# Altium schematic sheet RGMII_SDIO_I2S.SchDoc: RK3399 COB Design V1.0
size A3; Author: ABC; Organization: Altium Limited; Address1: L3, 12a Rodborough Rd; Address2: Frenchs Forest; Address3: NSW; Address4: Australia 2086; DocumentNumber: 11; SheetNumber: 11; SheetTotal: 27; PROJECT CODE: A_V1.0
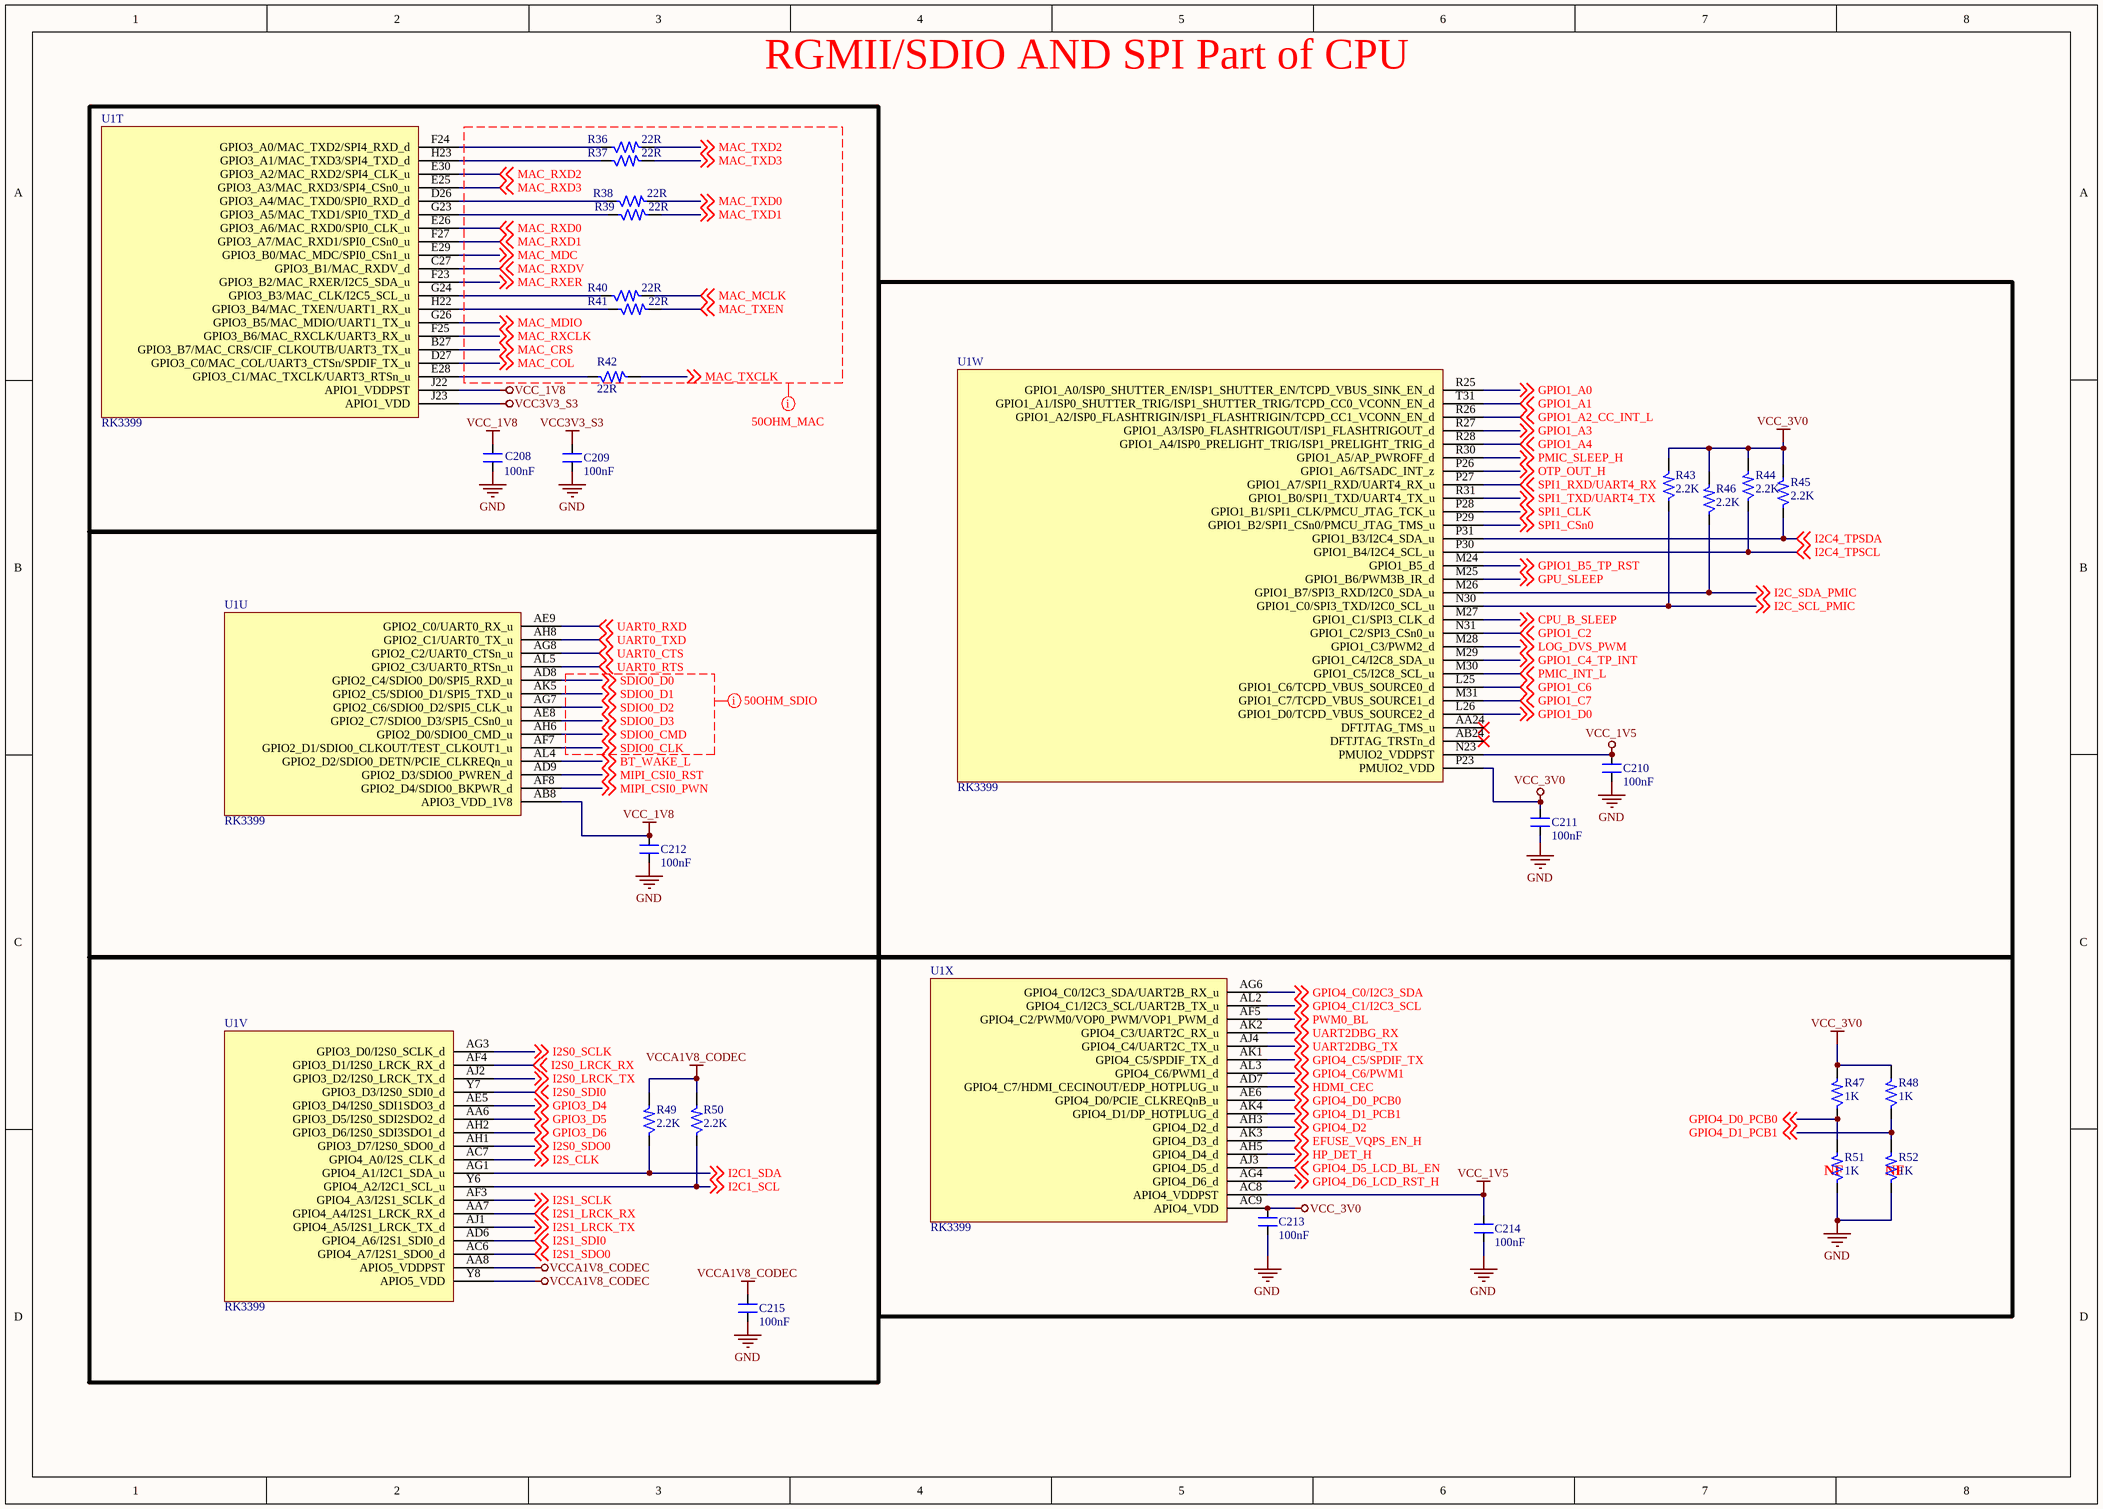
[diagram p0: RGMII_SDIO_I2S.SchDoc]

## Parts
C208  100nF  [CAP_0201]
C209  100nF  [CAP_0201]
C210  100nF  [CAP_0201]
C211  100nF  [CAP_0201]
C212  100nF  [CAP_0201]
C213  100nF  [CAP_0201]
C214  100nF  [CAP_0201]
C215  100nF  [CAP_0201]
R36  22R  [RES_0201]
R37  22R  [RES_0201]
R38  22R  [RES_0201]
R39  22R  [RES_0201]
R40  22R  [RES_0201]
R41  22R  [RES_0201]
R42  22R  [RES_0201]
R43  2.2K  [RES_0201]
R44  2.2K  [RES_0201]
R45  2.2K  [RES_0201]
R46  2.2K  [RES_0201]
R47  1K  [RES_0201]
R48  1K  [RES_0201]
R49  2.2K  [RES_0201]
R50  2.2K  [RES_0201]
R51  1K  [RES_0201]
R52  1K  [RES_0201]
U1  RK3399  [FBGA828_23_826X826]  (parts T,U,V,W,X of 24)

## Nets
GND: C208.1 C209.1 C210.1 C211.1 C212.1 C213.1 C214.1 C215.1 R51.1 R52.1
VCC3V3_S3: C209.2 U1.J23(APIO1_VDD)
VCC_1V5: C210.2 C214.2 U1.AC8(APIO4_VDDPST) U1.N23(PMUIO2_VDDPST)
VCC_1V8: C208.2 C212.2 U1.AB8(APIO3_VDD_1V8) U1.J22(APIO1_VDDPST)
VCC_3V0: C211.2 C213.2 R43.2 R44.2 R45.2 R46.2 R47.2 R48.2 U1.AC9(APIO4_VDD) U1.P23(PMUIO2_VDD)
VCCA1V8_CODEC: C215.2 R49.2 R50.2 U1.AA8(APIO5_VDDPST) U1.Y8(APIO5_VDD)
BT_WAKE_L: U1.AL4(GPIO2_D2/SDIO0_DETN/PCIE_CLKREQn_u) ; off-sheet BT_WAKE_L
CPU_B_SLEEP: U1.M27(GPIO1_C1/SPI3_CLK_d) ; off-sheet CPU_B_SLEEP
EFUSE_VQPS_EN_H: U1.AK3(GPIO4_D3_d) ; off-sheet EFUSE_VQPS_EN_H
GPIO1_A0: U1.R25(GPIO1_A0/ISP0_SHUTTER_EN/ISP1_SHUTTER_EN/TCPD_VBUS_SINK_EN_d) ; off-sheet GPIO1_A0
GPIO1_A1: U1.T31(GPIO1_A1/ISP0_SHUTTER_TRIG/ISP1_SHUTTER_TRIG/TCPD_CC0_VCONN_EN_d) ; off-sheet GPIO1_A1
GPIO1_A2_CC_INT_L: U1.R26(GPIO1_A2/ISP0_FLASHTRIGIN/ISP1_FLASHTRIGIN/TCPD_CC1_VCONN_EN_d) ; off-sheet GPIO1_A2_CC_INT_L
GPIO1_A3: U1.R27(GPIO1_A3/ISP0_FLASHTRIGOUT/ISP1_FLASHTRIGOUT_d) ; off-sheet GPIO1_A3
GPIO1_A4: U1.R28(GPIO1_A4/ISP0_PRELIGHT_TRIG/ISP1_PRELIGHT_TRIG_d) ; off-sheet GPIO1_A4
GPIO1_B5_TP_RST: U1.M24(GPIO1_B5_d) ; off-sheet GPIO1_B5_TP_RST
GPIO1_C2: U1.N31(GPIO1_C2/SPI3_CSn0_u) ; off-sheet GPIO1_C2
GPIO1_C4_TP_INT: U1.M29(GPIO1_C4/I2C8_SDA_u) ; off-sheet GPIO1_C4_TP_INT
GPIO1_C6: U1.L25(GPIO1_C6/TCPD_VBUS_SOURCE0_d) ; off-sheet GPIO1_C6
GPIO1_C7: U1.M31(GPIO1_C7/TCPD_VBUS_SOURCE1_d) ; off-sheet GPIO1_C7
GPIO1_D0: U1.L26(GPIO1_D0/TCPD_VBUS_SOURCE2_d) ; off-sheet GPIO1_D0
GPIO3_D4: U1.AE5(GPIO3_D4/I2S0_SDI1SDO3_d) ; off-sheet GPIO3_D4
GPIO3_D5: U1.AA6(GPIO3_D5/I2S0_SDI2SDO2_d) ; off-sheet GPIO3_D5
GPIO3_D6: U1.AH2(GPIO3_D6/I2S0_SDI3SDO1_d) ; off-sheet GPIO3_D6
GPIO4_C0/I2C3_SDA: U1.AG6(GPIO4_C0/I2C3_SDA/UART2B_RX_u) ; off-sheet GPIO4_C0/I2C3_SDA
GPIO4_C1/I2C3_SCL: U1.AL2(GPIO4_C1/I2C3_SCL/UART2B_TX_u) ; off-sheet GPIO4_C1/I2C3_SCL
GPIO4_C5/SPDIF_TX: U1.AK1(GPIO4_C5/SPDIF_TX_d) ; off-sheet GPIO4_C5/SPDIF_TX
GPIO4_C6/PWM1: U1.AL3(GPIO4_C6/PWM1_d) ; off-sheet GPIO4_C6/PWM1
GPIO4_D0_PCB0: R47.1 R51.2 U1.AE6(GPIO4_D0/PCIE_CLKREQnB_u) ; off-sheet GPIO4_D0_PCB0
GPIO4_D1_PCB1: R48.1 R52.2 U1.AK4(GPIO4_D1/DP_HOTPLUG_d) ; off-sheet GPIO4_D1_PCB1
GPIO4_D2: U1.AH3(GPIO4_D2_d) ; off-sheet GPIO4_D2
GPIO4_D5_LCD_BL_EN: U1.AJ3(GPIO4_D5_d) ; off-sheet GPIO4_D5_LCD_BL_EN
GPIO4_D6_LCD_RST_H: U1.AG4(GPIO4_D6_d) ; off-sheet GPIO4_D6_LCD_RST_H
GPU_SLEEP: U1.M25(GPIO1_B6/PWM3B_IR_d) ; off-sheet GPU_SLEEP
HDMI_CEC: U1.AD7(GPIO4_C7/HDMI_CECINOUT/EDP_HOTPLUG_u) ; off-sheet HDMI_CEC
HP_DET_H: U1.AH5(GPIO4_D4_d) ; off-sheet HP_DET_H
I2C1_SCL: R50.1 U1.Y6(GPIO4_A2/I2C1_SCL_u) ; off-sheet I2C1_SCL
I2C1_SDA: R49.1 U1.AG1(GPIO4_A1/I2C1_SDA_u) ; off-sheet I2C1_SDA
I2C4_TPSCL: R44.1 U1.P30(GPIO1_B4/I2C4_SCL_u) ; off-sheet I2C4_TPSCL
I2C4_TPSDA: R45.1 U1.P31(GPIO1_B3/I2C4_SDA_u) ; off-sheet I2C4_TPSDA
I2C_SCL_PMIC: R43.1 U1.N30(GPIO1_C0/SPI3_TXD/I2C0_SCL_u) ; off-sheet I2C_SCL_PMIC
I2C_SDA_PMIC: R46.1 U1.M26(GPIO1_B7/SPI3_RXD/I2C0_SDA_u) ; off-sheet I2C_SDA_PMIC
I2S0_LRCK_RX: U1.AF4(GPIO3_D1/I2S0_LRCK_RX_d) ; off-sheet I2S0_LRCK_RX
I2S0_LRCK_TX: U1.AJ2(GPIO3_D2/I2S0_LRCK_TX_d) ; off-sheet I2S0_LRCK_TX
I2S0_SCLK: U1.AG3(GPIO3_D0/I2S0_SCLK_d) ; off-sheet I2S0_SCLK
I2S0_SDI0: U1.Y7(GPIO3_D3/I2S0_SDI0_d) ; off-sheet I2S0_SDI0
I2S0_SDO0: U1.AH1(GPIO3_D7/I2S0_SDO0_d) ; off-sheet I2S0_SDO0
I2S1_LRCK_RX: U1.AA7(GPIO4_A4/I2S1_LRCK_RX_d) ; off-sheet I2S1_LRCK_RX
I2S1_LRCK_TX: U1.AJ1(GPIO4_A5/I2S1_LRCK_TX_d) ; off-sheet I2S1_LRCK_TX
I2S1_SCLK: U1.AF3(GPIO4_A3/I2S1_SCLK_d) ; off-sheet I2S1_SCLK
I2S1_SDI0: U1.AD6(GPIO4_A6/I2S1_SDI0_d) ; off-sheet I2S1_SDI0
I2S1_SDO0: U1.AC6(GPIO4_A7/I2S1_SDO0_d) ; off-sheet I2S1_SDO0
I2S_CLK: U1.AC7(GPIO4_A0/I2S_CLK_d) ; off-sheet I2S_CLK
LOG_DVS_PWM: U1.M28(GPIO1_C3/PWM2_d) ; off-sheet LOG_DVS_PWM
MAC_COL: U1.D27(GPIO3_C0/MAC_COL/UART3_CTSn/SPDIF_TX_u) ; off-sheet MAC_COL
MAC_CRS: U1.B27(GPIO3_B7/MAC_CRS/CIF_CLKOUTB/UART3_TX_u) ; off-sheet MAC_CRS
MAC_MCLK: R40.2 ; off-sheet MAC_MCLK
MAC_MDC: U1.E29(GPIO3_B0/MAC_MDC/SPI0_CSn1_u) ; off-sheet MAC_MDC
MAC_MDIO: U1.G26(GPIO3_B5/MAC_MDIO/UART1_TX_u) ; off-sheet MAC_MDIO
MAC_RXCLK: U1.F25(GPIO3_B6/MAC_RXCLK/UART3_RX_u) ; off-sheet MAC_RXCLK
MAC_RXD0: U1.E26(GPIO3_A6/MAC_RXD0/SPI0_CLK_u) ; off-sheet MAC_RXD0
MAC_RXD1: U1.F27(GPIO3_A7/MAC_RXD1/SPI0_CSn0_u) ; off-sheet MAC_RXD1
MAC_RXD2: U1.E30(GPIO3_A2/MAC_RXD2/SPI4_CLK_u) ; off-sheet MAC_RXD2
MAC_RXD3: U1.E25(GPIO3_A3/MAC_RXD3/SPI4_CSn0_u) ; off-sheet MAC_RXD3
MAC_RXDV: U1.C27(GPIO3_B1/MAC_RXDV_d) ; off-sheet MAC_RXDV
MAC_RXER: U1.F23(GPIO3_B2/MAC_RXER/I2C5_SDA_u) ; off-sheet MAC_RXER
MAC_TXCLK: R42.2 ; off-sheet MAC_TXCLK
MAC_TXD0: R38.2 ; off-sheet MAC_TXD0
MAC_TXD1: R39.2 ; off-sheet MAC_TXD1
MAC_TXD2: R36.2 ; off-sheet MAC_TXD2
MAC_TXD3: R37.2 ; off-sheet MAC_TXD3
MAC_TXEN: R41.2 ; off-sheet MAC_TXEN
MIPI_CSI0_PWN: U1.AF8(GPIO2_D4/SDIO0_BKPWR_d) ; off-sheet MIPI_CSI0_PWN
MIPI_CSI0_RST: U1.AD9(GPIO2_D3/SDIO0_PWREN_d) ; off-sheet MIPI_CSI0_RST
OTP_OUT_H: U1.P26(GPIO1_A6/TSADC_INT_z) ; off-sheet OTP_OUT_H
PMIC_INT_L: U1.M30(GPIO1_C5/I2C8_SCL_u) ; off-sheet PMIC_INT_L
PMIC_SLEEP_H: U1.R30(GPIO1_A5/AP_PWROFF_d) ; off-sheet PMIC_SLEEP_H
PWM0_BL: U1.AF5(GPIO4_C2/PWM0/VOP0_PWM/VOP1_PWM_d) ; off-sheet PWM0_BL
SDIO0_CLK: U1.AF7(GPIO2_D1/SDIO0_CLKOUT/TEST_CLKOUT1_u) ; off-sheet SDIO0_CLK
SDIO0_CMD: U1.AH6(GPIO2_D0/SDIO0_CMD_u) ; off-sheet SDIO0_CMD
SDIO0_D0: U1.AD8(GPIO2_C4/SDIO0_D0/SPI5_RXD_u) ; off-sheet SDIO0_D0
SDIO0_D1: U1.AK5(GPIO2_C5/SDIO0_D1/SPI5_TXD_u) ; off-sheet SDIO0_D1
SDIO0_D2: U1.AG7(GPIO2_C6/SDIO0_D2/SPI5_CLK_u) ; off-sheet SDIO0_D2
SDIO0_D3: U1.AE8(GPIO2_C7/SDIO0_D3/SPI5_CSn0_u) ; off-sheet SDIO0_D3
SPI1_CLK: U1.P28(GPIO1_B1/SPI1_CLK/PMCU_JTAG_TCK_u) ; off-sheet SPI1_CLK
SPI1_CSn0: U1.P29(GPIO1_B2/SPI1_CSn0/PMCU_JTAG_TMS_u) ; off-sheet SPI1_CSn0
SPI1_RXD/UART4_RX: U1.P27(GPIO1_A7/SPI1_RXD/UART4_RX_u) ; off-sheet SPI1_RXD/UART4_RX
SPI1_TXD/UART4_TX: U1.R31(GPIO1_B0/SPI1_TXD/UART4_TX_u) ; off-sheet SPI1_TXD/UART4_TX
UART0_CTS: U1.AG8(GPIO2_C2/UART0_CTSn_u) ; off-sheet UART0_CTS
UART0_RTS: U1.AL5(GPIO2_C3/UART0_RTSn_u) ; off-sheet UART0_RTS
UART0_RXD: U1.AE9(GPIO2_C0/UART0_RX_u) ; off-sheet UART0_RXD
UART0_TXD: U1.AH8(GPIO2_C1/UART0_TX_u) ; off-sheet UART0_TXD
UART2DBG_RX: U1.AK2(GPIO4_C3/UART2C_RX_u) ; off-sheet UART2DBG_RX
UART2DBG_TX: U1.AJ4(GPIO4_C4/UART2C_TX_u) ; off-sheet UART2DBG_TX
NetR36_1: R36.1 U1.F24(GPIO3_A0/MAC_TXD2/SPI4_RXD_d)
NetR37_1: R37.1 U1.H23(GPIO3_A1/MAC_TXD3/SPI4_TXD_d)
NetR38_1: R38.1 U1.D26(GPIO3_A4/MAC_TXD0/SPI0_RXD_d)
NetR39_1: R39.1 U1.G23(GPIO3_A5/MAC_TXD1/SPI0_TXD_d)
NetR40_1: R40.1 U1.G24(GPIO3_B3/MAC_CLK/I2C5_SCL_u)
NetR41_1: R41.1 U1.H22(GPIO3_B4/MAC_TXEN/UART1_RX_u)
NetR42_1: R42.1 U1.E28(GPIO3_C1/MAC_TXCLK/UART3_RTSn_u)

Not connected (* = marked no-connect by the designer): U1 AA24(DFTJTAG_TMS_u)* AB24(DFTJTAG_TRSTn_d)*

## Layout directives
net class 50OHM_MAC: MAC_COL, MAC_CRS, MAC_MCLK, MAC_MDC, MAC_MDIO, MAC_RXCLK, MAC_RXD0, MAC_RXD1, MAC_RXD2, MAC_RXD3, MAC_RXDV, MAC_RXER, MAC_TXCLK, MAC_TXD0, MAC_TXD1, MAC_TXD2, MAC_TXD3, MAC_TXEN
net class 50OHM_SDIO: SDIO0_CLK, SDIO0_CMD, SDIO0_D0, SDIO0_D1, SDIO0_D2, SDIO0_D3

## Notes on the sheet
- RGMII/SDIO AND SPI Part of CPU
- (near R51) NF
- (near R52) NF
- TITLE:
- DOCUMENT NAME:
- SCALE 1:1
- This document is copyright of Esteempcb and shall not be revealed, produced, copied, in whole or in part, nor
- PROJECT CODE:
- TEMPLATE:
- A3
- AUTHOR:
- Sheet
- of
- used for any purpose other than submitted.

## Library data of the parts
C208-C215 = CAP_100nF-25V-10%-0201: 0.1µF ±10% 25V Ceramic Capacitor X5R 0201 (0603 Metric) /; Manufacturer: TDK Corporation; Manufacturer Part Number: C0603X5R1E104K030BB; Case/Package: 0201; Supplier-1: Digikey
R36-R42 = RES_22R-0.05W-1%-0201: 22 Ohms ±1% 0.05W, 1/20W Chip Resistor 0201 (0603 Metric) Moisture Resistant Thick Film /; Manufacturer: Yageo; Manufacturer Part Number: RC0201FR-0722RL; Case/Package: 0201; Supplier-1: Digikey
R43-R46 R49 R50 = RES_2.2K-0.05W-1%-0201: 2.2 kOhms ±1% 0.05W, 1/20W Chip Resistor 0201 (0603 Metric) Thick Film /; Manufacturer: Stackpole Electronics Inc; Manufacturer Part Number: RMCF0201FT2K20; Case/Package: 0201; Supplier-1: Digikey
R47 R48 R51 R52 = RES_1K-0.05W-1%-0201: 1 kOhms ±1% 0.05W, 1/20W Chip Resistor 0201 (0603 Metric) Thick Film /; Manufacturer: Yageo; Manufacturer Part Number: RC0201FR-071KL; Case/Package: 0201; Supplier-1: Digikey
U1 = IC_RK3399-FCBGA828: RK3399 is a low power, high performance processor for computing, personal mobile.; Manufacturer: Rockchip; Manufacturer Part Number: RK3399; Case/Package: FCBGA828; Supplier-1: Rockchip